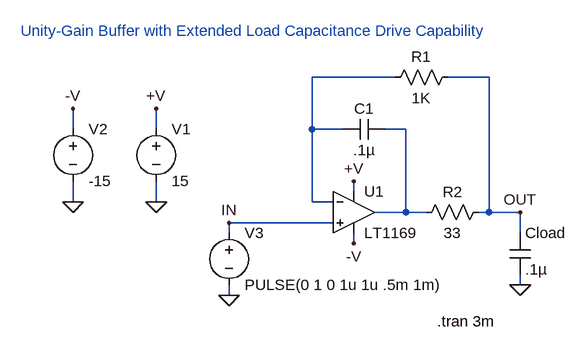
[diagram p0: schematic 1169.asc]
1169.asc, the LTspice schematic file:
Version 4
SHEET 1 896 680
WIRE 256 32 128 32
WIRE 400 32 336 32
WIRE -240 112 -240 80
WIRE -112 112 -112 80
WIRE 128 112 128 32
WIRE 176 112 128 112
WIRE 272 112 240 112
WIRE 192 208 192 192
WIRE -240 224 -240 192
WIRE -112 224 -112 192
WIRE 128 224 128 112
WIRE 160 224 128 224
WIRE 272 240 272 112
WIRE 272 240 224 240
WIRE 304 240 272 240
WIRE 400 240 400 32
WIRE 400 240 384 240
WIRE 448 240 400 240
WIRE 160 256 0 256
WIRE 0 272 0 256
WIRE 448 272 448 240
WIRE 192 288 192 272
WIRE 448 352 448 336
WIRE 0 368 0 352
FLAG -112 224 0
FLAG 192 192 +V
FLAG -112 80 +V
FLAG 192 288 -V
FLAG -240 224 0
FLAG -240 80 -V
FLAG 0 368 0
FLAG 448 352 0
FLAG 0 256 IN
FLAG 448 240 OUT
SYMBOL voltage -112 96 R0
SYMATTR InstName V1
SYMATTR Value 15
SYMBOL voltage -240 96 R0
SYMATTR InstName V2
SYMATTR Value -15
SYMBOL res 352 16 R90
WINDOW 0 0 56 VBottom 0
WINDOW 3 32 56 VTop 0
SYMATTR InstName R1
SYMATTR Value 1K
SYMBOL voltage 0 256 R0
SYMATTR InstName V3
SYMATTR Value PULSE(0 1 0 1u 1u .5m 1m)
SYMBOL opamps\\LT1169 192 176 R0
SYMATTR InstName U1
SYMBOL res 400 224 R90
WINDOW 0 0 56 VBottom 0
WINDOW 3 32 56 VTop 0
SYMATTR InstName R2
SYMATTR Value 33
SYMBOL cap 240 96 R90
WINDOW 0 0 32 VBottom 0
WINDOW 3 32 32 VTop 0
SYMATTR InstName C1
SYMATTR Value .1µ
SYMBOL cap 432 336 M180
WINDOW 0 24 64 Left 0
WINDOW 3 24 8 Left 0
SYMATTR InstName Cload
SYMATTR Value .1µ
TEXT 320 408 Left 0 !.tran 3m
TEXT 40 -24 Bottom 0 ;Unity-Gain Buffer with Extended Load Capacitance Drive Capability

The netlist it stands for:
* 1169.asc
V1 +V 0 15
V2 -V 0 -15
R1 OUT N001 1K
V3 IN 0 PULSE(0 1 0 1u 1u .5m 1m)
XU1 IN N001 +V -V N002 LT1169  ; pins In+ In- V+ V- OUT
R2 OUT N002 33
C1 N002 N001 .1µ
Cload 0 OUT .1µ
.tran 3m
* Unity-Gain Buffer with Extended Load Capacitance Drive Capability
.backanno
.end